# EAGLE design Day0 - Rhenetou Virginio -13215022 (EAGLE 7.6.0)
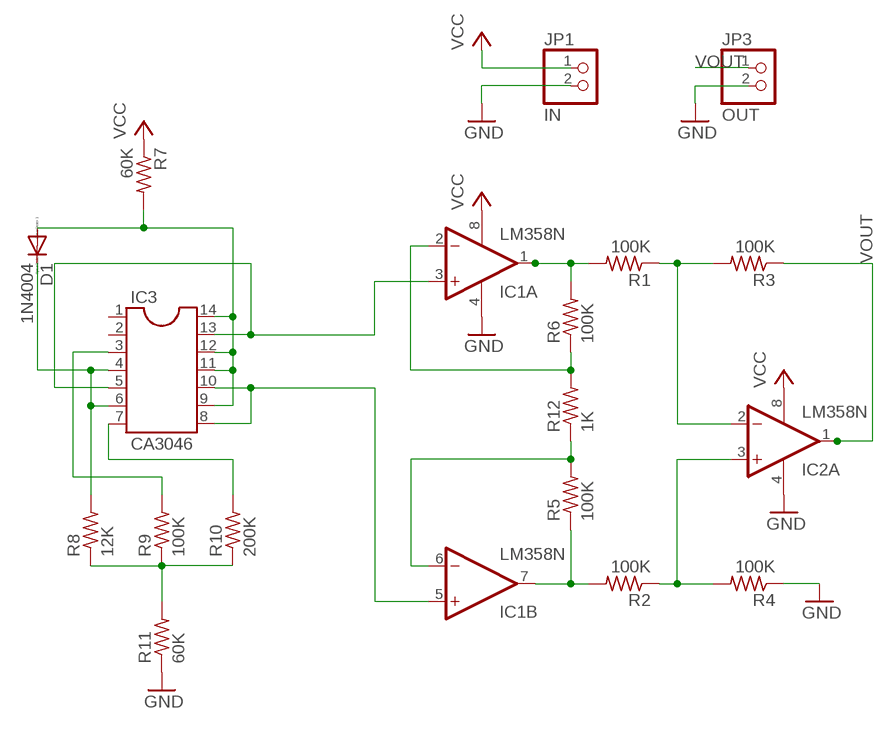
[diagram p0: schematic, sheet 1]

## Parts
D1  1N4004  DIODE-D-7.5  [D-7.5]
IC1  LM358N  [DIL08]
IC2  LM358N  [DIL08]
IC3  CA3046  DIL14  [DIL14]
JP1  IN  PINHD-1X2  [1X02]
JP3  OUT  PINHD-1X2  [1X02]
R1  100K  R-US_0204/7  [0204/7]
R2  100K  R-US_0204/7  [0204/7]
R3  100K  R-US_0204/7  [0204/7]
R4  100K  R-US_0204/7  [0204/7]
R5  100K  R-US_0204/7  [0204/7]
R6  100K  R-US_0204/7  [0204/7]
R7  60K  R-US_0204/7  [0204/7]
R8  12K  R-US_0204/7  [0204/7]
R9  100K  R-US_0204/7  [0204/7]
R10  200K  R-US_0204/7  [0204/7]
R11  60K  R-US_0204/7  [0204/7]
R12  1K  R-US_0204/7  [0204/7]

## Nets
GND: IC1.4(P:V-) IC2.4(P:V-) JP1.2 JP3.2 R4.1 R11.1
N$1: D1.A IC3.9 IC3.11 IC3.12 IC3.14 R7.2
N$2: D1.C IC3.4 IC3.6 R8.2
N$3: IC3.3 R9.2
N$4: IC3.7 R10.2
N$5: R8.1 R9.1 R10.1 R11.2
N$6: IC1.3(A:+IN) IC3.5 IC3.13
N$7: IC1.5(B:+IN) IC3.8 IC3.10
N$9: IC1.7(B:OUT) R2.2 R5.1
N$10: IC2.2(A:-IN) R1.1 R3.2
N$11: IC1.2(A:-IN) R6.1 R12.2
N$12: IC1.6(B:-IN) R5.2 R12.1
N$13: IC1.1(A:OUT) R1.2 R6.2
N$14: IC2.3(A:+IN) R2.1 R4.2
VCC: IC1.8(P:V+) IC2.8(P:V+) JP1.1 R7.1
VOUT: IC2.1(A:OUT) JP3.1 R3.1
Unconnected: IC2.5(B:+IN) IC2.6(B:-IN) IC2.7(B:OUT) IC3.1 IC3.2

## Library data of the parts
D1 = diode:DIODE-: DIODE
IC1 IC2 = linear:LM358: OP AMP also LM158; LM258; LM2904 Source: http://cache.national.com/ds/LM/LM158.pdf
IC3 = ic-package:DIL14: Dual In Line / Socket
JP1 JP3 = pinhead:PINHD-1X2: PIN HEADER
R1-R12 = resistor:R-US_: RESISTOR, American symbol

## Board
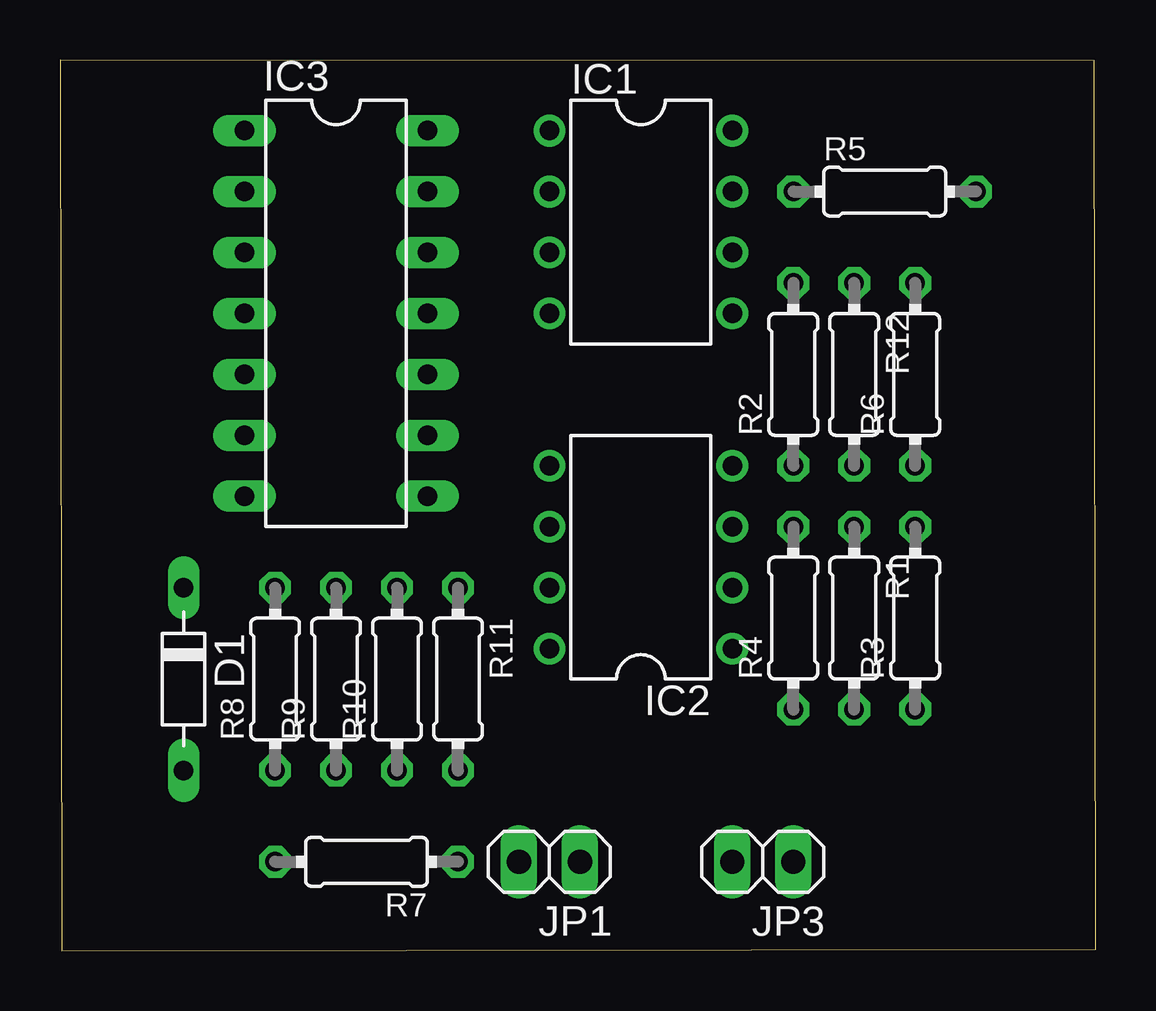
[diagram p1: board, top side]
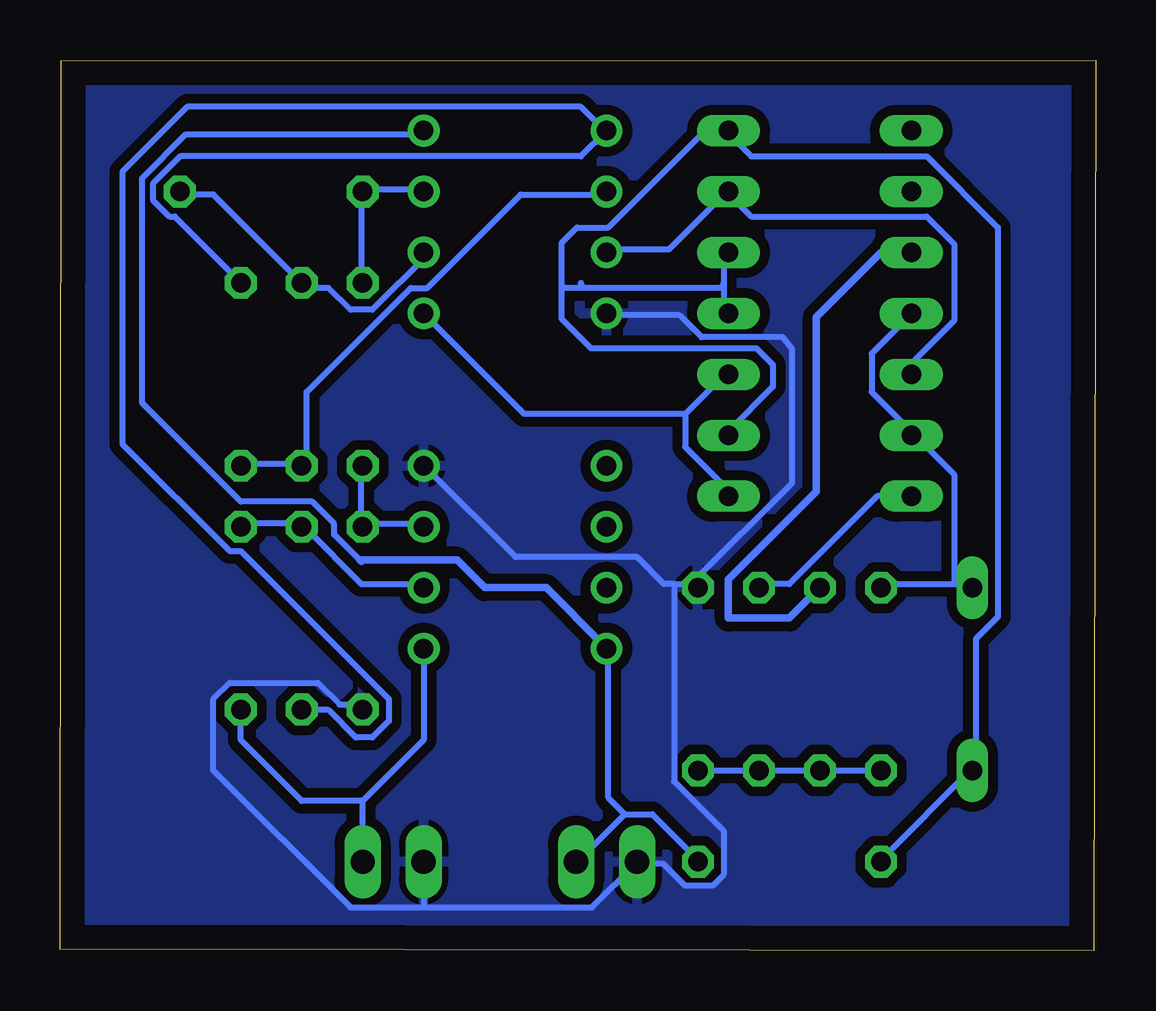
[diagram p2: board, bottom side, seen from below]

Size 43.16 x 37.14 mm. Coordinates in mm from the lower left corner, seen from the top.
Outline: 0.08,0 43.16,0.07 43.1,37.11 0,37.14 0.08,0
Copper layers (1*16): Top 0.035mm / dielectric 1.5mm / Bottom 0.035mm
Design rules "default": minimum track width 10mil, minimum drill 24mil, track to track 8mil, track to pad 8mil, pad to pad 8mil, via to via 8mil, smd to smd 8mil, copper to edge 40mil, drill to drill 8mil, minimum pad ring 10mil, minimum via ring 8mil, stop-mask expansion 4mil, vias tented up to drill 0mil, thermal gap 10mil

### Footprints (pad centres in the part's own frame; a part is rotated, then mirrored left to right if it is on the bottom)
D-7.5 = drill 0.813 long: A 3.81,0; C -3.81,0
DIL08 = drill 0.813 pad 1.27: 1 -3.81,-3.81; 2 -1.27,-3.81; 3 1.27,-3.81; 4 3.81,-3.81; 5 3.81,3.81; 6 1.27,3.81; 7 -1.27,3.81; 8 -3.81,3.81
DIL14 = drill 0.813 long: 1 -7.62,-3.81; 2 -5.08,-3.81; 3 -2.54,-3.81; 4 0,-3.81; 5 2.54,-3.81; 6 5.08,-3.81; 7 7.62,-3.81; 8 7.62,3.81; 9 5.08,3.81; 10 2.54,3.81; 11 0,3.81; 12 -2.54,3.81; 13 -5.08,3.81; 14 -7.62,3.81
1X02 = drill 1.016 long: 1 -1.27,0; 2 1.27,0
0204/7 = drill 0.813 octagon: 1 -3.81,0; 2 3.81,0

### Placement (x,y rotation side)
D1  5.15,11.34 270 top
IC1  24.2,30.39 270 top
IC2  24.2,16.42 90 top
IC3  11.5,26.58 270 top
JP1  20.39,3.72 180 top
JP3  29.28,3.72 180 top
R1  33.09,13.88 270 top
R2  30.55,24.04 90 top
R3  35.63,13.88 90 top
R4  30.55,13.88 90 top
R5  34.36,31.66 0 top
R6  35.63,24.04 90 top
R7  12.77,3.72 180 top
R8  8.96,11.34 90 top
R9  11.5,11.34 90 top
R10  14.04,11.34 90 top
R11  16.58,11.34 270 top
R12  33.09,24.04 270 top

### Tracks (layer width: path | path; a pad name or v marks a point on that pad's centre or on a via)
GND
  Bottom 0.254: R4.1 30.6,10.27 31.52,10.27 32.43,11.18 36.09,11.18 36.78,10.5 36.78,7.53 31.06,1.81 28.01,1.81 | 28.01,1.81 21,1.81 19.17,3.64 JP1.2 18.94,3.64 18.03,3.64 17.12,2.72 15.97,2.72 15.52,3.18 15.52,5.01 17.57,7.07 17.57,15.3 | 27.86,3.64 JP3.2 28.01,1.81 | 17.57,15.3 16.66,15.3 R11.1 16.7,15.15 16.81,15.26 16.81,15.35 12.66,19.5 12.66,25.09 13.05,25.58 16.43,25.58 17.34,26.5 20.32,26.5 IC1.4 | IC2.4 27.86,20.1 24.18,16.42 19.12,16.42 18,15.3 17.57,15.3
  pour Bottom (isolate 0.406): 0.06,37.08 43.08,37.08 43.08,-0.06 0.02,-0.06 0.02,37.08
N$1
  Bottom 0.254: R7.2 8.89,3.87 5.23,7.53 D1.A 5,7.53 5,13.01 4.09,13.93 4.09,30.16 7.06,33.13 14.37,33.13 15.29,34.04 IC3.14 15.52,34.04 16.43,34.04 20.32,30.16 21.62,30.16 22.25,29.53 22.25,27.73 | 21.26,27.64 15.72,27.64 arc-90 15.52,27.85 | IC3.9 15.29,21.7 13.46,23.53 13.46,24.44 14.14,25.13 21.04,25.13 22.25,26.34 22.25,27.73 | 15.52,26.73 IC3.11 arc90 15.52,26.78 15.52,27.85 | IC3.12 15.52,29.01 15.52,27.85 | 21.26,27.64 arc90 21.46,27.85 | 22.25,27.73 22.16,27.64 21.26,27.64
N$2
  Bottom 0.254: 5.91,15.3 8.89,15.3 R8.2 | 5.91,15.3 5.23,15.3 D1.C | IC3.4 7.74,26.5 9.34,24.9 9.34,23.3 7.74,21.7 IC3.6 7.51,21.47 5.91,19.87 5.91,15.3
N$3
  Bottom 0.305: IC3.3 8.96,29.12 11.65,26.43 11.65,19.15 15.31,15.49 15.31,13.88 12.77,13.88 R9.2
N$4
  Bottom 0.254: IC3.7 9.11,18.96 12.77,15.3 13.92,15.3 R10.2
N$5
  Bottom 0.254: R8.1 R9.1 R10.1 R11.2
N$6
  Bottom 0.254: IC3.5 7.51,24.21 7.51,24.67 5.91,26.27 5.91,29.47 7.06,30.61 14.37,30.61 15.29,31.53 IC3.13 15.52,31.53 17.8,29.24 20.32,29.24 IC1.3
N$7
  Bottom 0.254: 17.12,22.38 17.12,21.01 15.52,19.41 15.52,18.96 IC3.8 | 17.12,22.38 15.52,23.98 IC3.10 | 27.86,26.5 IC1.5 23.82,22.38 17.12,22.38
N$9
  Bottom 0.254: IC1.7 28.09,31.76 30.37,31.76 R5.1 30.6,31.53 30.6,27.87 R2.2
N$10
  Bottom 0.254: IC2.2 28.09,15.3 30.6,15.3 32.89,17.58 R1.1 33.12,17.81 35.63,17.81 R3.2
N$11
  Bottom 0.254: R6.1 35.63,20.33 33.12,20.33 R12.2 32.89,20.33 32.89,23.3 28.55,27.64 27.86,27.64 23.97,31.53 20.54,31.53 IC1.2
N$12
  Bottom 0.254: IC1.6 27.86,29.01 30.15,26.73 31.06,26.73 31.97,27.64 32.89,27.64 R12.1 36.78,31.53 38.15,31.53 R5.2
N$13
  Bottom 0.254: R1.2 32.89,10.04 31.97,10.04 30.83,8.9 30.15,8.9 29.46,9.58 29.46,10.5 35.63,16.67 36.09,16.67 40.56,21.14 40.56,32.49 37.86,35.19 21.46,35.19 20.54,34.27 IC1.1 21.46,33.13 38.15,33.13 39.29,31.99 39.29,31.3 38.6,30.61 38.38,30.61 35.63,27.87 R6.2
N$14
  Bottom 0.254: IC2.3 28.09,17.81 30.37,17.81 R4.2 30.6,17.81 30.6,20.1 R2.1
VCC
  Bottom 0.254: 19.63,5.7 18.49,5.7 16.66,3.87 R7.1 | 19.63,5.7 21.46,3.87 JP1.1 | 19.63,5.7 20.32,6.38 20.32,12.55 IC2.8 20.54,12.78 | 30.6,16.21 30.68,16.29 31.75,17.36 31.75,17.81 32.66,18.73 35.63,18.73 39.75,22.84 39.75,32.21 37.92,34.04 28.09,34.04 IC1.8
  Bottom 0.305: 20.54,12.78 22.91,15.15 25.47,15.15 26.62,16.29 30.68,16.29
VOUT
  Bottom 0.254: 35.63,10.04 R3.1 35.63,8.8 33.09,6.26 30.55,6.26 | IC2.1 28.01,8.8 30.55,6.26 | JP3.1 30.55,6.26

### Text on the board
tValues: DAY0-Kelompok-9